# Altium schematic sheet LM-003.SchDoc (part 2 of 3)
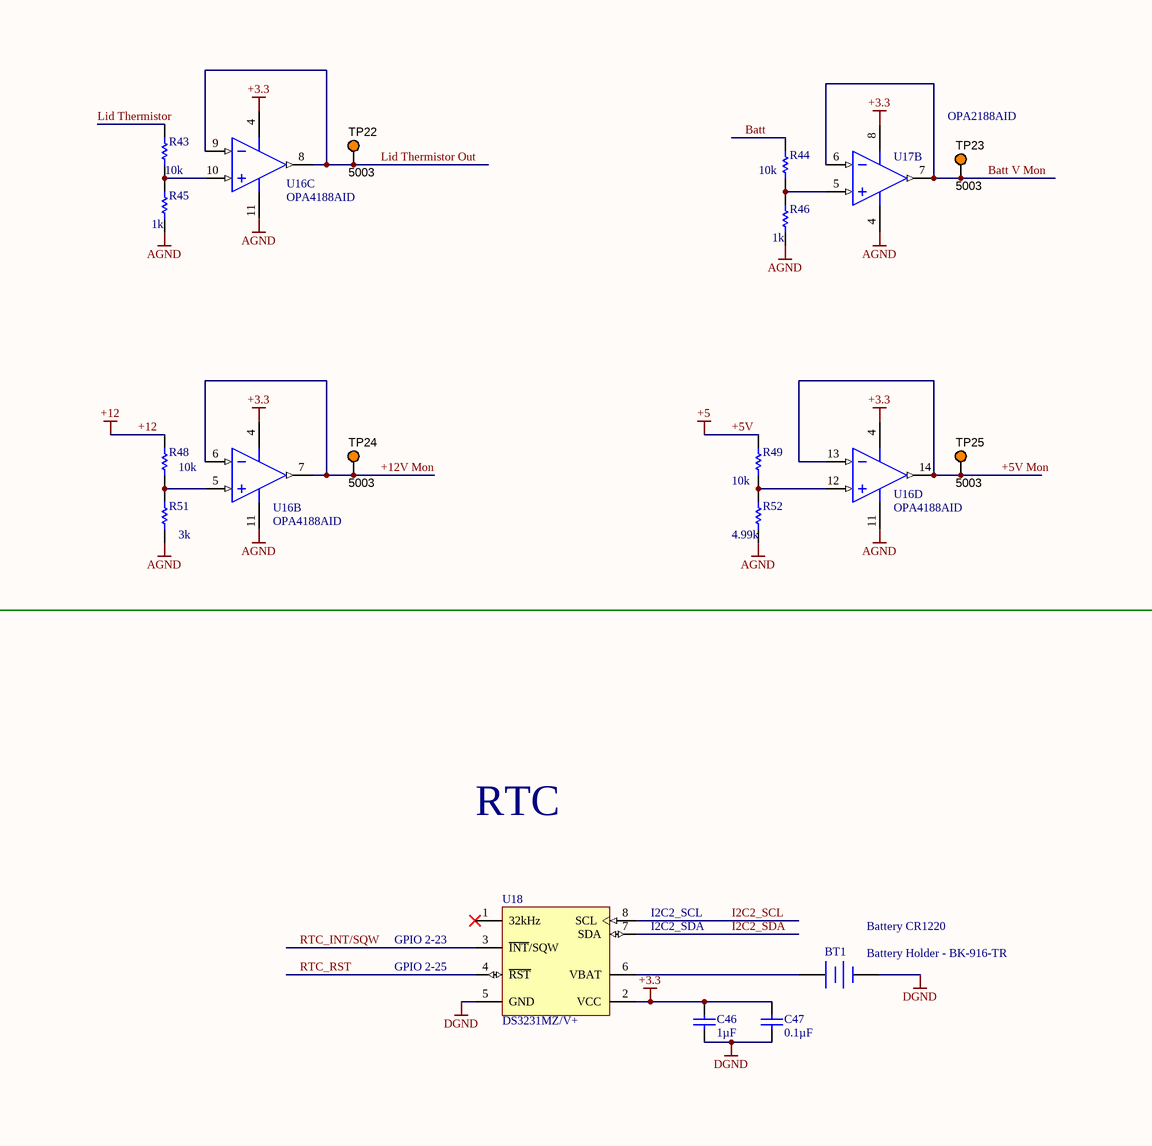
[diagram p9: LM-003.SchDoc, bottom right]
## Library data of the parts
BT1 = Battery: CR1220, 1225 BATTERY RETAINER W/; Manufacturer 1: MPD (Memory Protection Devices); Category 1: Battery Products; Battery Type, Function: Coin Cell, Retainer; Battery Cell Size: Coin, 12.0mm; Number of Cells: 1; Battery Series: 1216, 1220, 1225; Supplier 1: Digi-Key; Supplier Part Number 1: BK-916-CT-ND; Manufacturer Part Number 1: BK-916-TR; RoHS 1: RoHS Compliant; Description 1: CR1220, 1225 BATTERY RETAINER W/; Stock 1: 7084; Pricing 1: 1=0.49, 10=0.449, 100=0.408, 500=0.357 (USD); Part Status: Active; Style: Retainer; Mounting Type: PCB, Surface Mount; Termination Style: SMD (SMT) Tab; Height Above Board: 0.551" (14.00mm); Operating Temperature: -; ComponentLink1URL: http://www.memoryprotectiondevices.com/datasheets/BK-916-datasheet.pdf; ComponentLink1Description: http://www.memoryprotectiondevices.com/datasheets/BK-916-datasheet.pdf
C1 C2 = CMP-1037-04913-1: Manufacturer: Murata Electronics North America; Manufacturer Part Number: GRM32RR71H105KA01L; Tolerance: ±10%; Supplier 1: Digi-Key; Supplier Part Number 1: 490-1863-6-ND; RoHS: RoHS Compliant; Category: Capacitors; Stock 1: 66890; Pricing 1: 1=0.35, 10=0.242, 100=0.1449, 500=0.10868 (USD); Packaging: Digi-Reel®; Part Status: Active; Voltage - Rated: 50V; Temperature Coefficient: X7R; Operating Temperature: -55°C ~ 125°C; Features: -; Ratings: -; Applications: General Purpose; Mounting Type: Surface Mount, MLCC; Package / Case: 1210 (3225 Metric); Size / Dimension: 0.126" L x 0.098" W (3.20mm x 2.50mm); Height - Seated (Max): -; Thickness (Max): 0.079" (2.00mm); Lead Spacing: -; Lead Style: -; ComponentLink1URL: http://search.murata.co.jp/Ceramy/image/img/A01X/G101/ENG/GRM32RR71H105KA01-01.pdf; ComponentLink1Description: http://search.murata.co.jp/Ceramy/image/img/A01X/G101/ENG/GRM32RR71H105KA01-01.pdf
C3 = CMP-1035-00578-1: Manufacturer: AVX Corporation; Manufacturer Part Number: 06035C220JAT2A; Tolerance: ±5%; Supplier 1: Digi-Key; Supplier Part Number 1: 478-6204-6-ND; RoHS: RoHS Compliant; Category: Capacitors; Stock 1: 72942; Pricing 1: 1=0.2, 10=0.136, 100=0.0688, 1000=0.04166 (USD); Packaging: Digi-Reel®; Part Status: Active; Voltage - Rated: 50V; Temperature Coefficient: X7R; Operating Temperature: -55°C ~ 125°C; Features: -; Ratings: -; Applications: General Purpose; Mounting Type: Surface Mount, MLCC; Package / Case: 0603 (1608 Metric); Size / Dimension: 0.063" L x 0.032" W (1.60mm x 0.81mm); Height - Seated (Max): -; Thickness (Max): 0.035" (0.90mm); Lead Spacing: -; Lead Style: -; ComponentLink1URL: http://datasheets.avx.com/X7RDielectric.pdf; ComponentLink1Description: http://datasheets.avx.com/X7RDielectric.pdf
C4 C7 = CMP-1036-04795-1: Manufacturer: Taiyo Yuden; Manufacturer Part Number: EMK212B7105KG-T; Tolerance: ±10%; Supplier 1: Digi-Key; Supplier Part Number 1: 587-1283-1-ND; RoHS: RoHS Compliant; Category: Capacitors; Stock 1: 41495; Pricing 1: 1=0.13, 10=0.089, 100=0.042, 1000=0.02439 (USD); Packaging: Cut Tape (CT); Part Status: Active; Voltage - Rated: 16V; Temperature Coefficient: X7R; Operating Temperature: -55°C ~ 125°C; Features: -; Ratings: -; Applications: General Purpose; Mounting Type: Surface Mount, MLCC; Package / Case: 0805 (2012 Metric); Size / Dimension: 0.079" L x 0.049" W (2.00mm x 1.25mm); Height - Seated (Max): -; Thickness (Max): 0.053" (1.35mm); Lead Spacing: -; Lead Style: -; ComponentLink1URL: http://ds.yuden.co.jp/TYCOMPAS/ut/detail.do?productNo=EMK212B7105KG-T&fileName=EMK212B7105KG-T_SS&mode=specSheetDownload; ComponentLink1Description: http://ds.yuden.co.jp/TYCOMPAS/ut/detail.do?productNo=EMK212B7105KG-T&fileName=EMK212B7105KG-T_SS&mode=specSheetDownload
C5 = CMP-1037-04913-1: Manufacturer: Murata Electronics North America; Manufacturer Part Number: GRM31MR71H474KA01L; Tolerance: ±10%; Supplier 1: Digi-Key; Supplier Part Number 1: 490-1781-6-ND; RoHS: RoHS Compliant; Category: Capacitors; Stock 1: 15644; Pricing 1: 1=0.45, 10=0.317, 100=0.209, 500=0.15482, 1000=0.13159 (USD); Packaging: Digi-Reel®; Part Status: Active; Voltage - Rated: 50V; Temperature Coefficient: X7R; Operating Temperature: -55°C ~ 125°C; Features: -; Ratings: -; Applications: General Purpose; Mounting Type: Surface Mount, MLCC; Package / Case: 1206 (3216 Metric); Size / Dimension: 0.126" L x 0.063" W (3.20mm x 1.60mm); Height - Seated (Max): -; Thickness (Max): 0.049" (1.25mm); Lead Spacing: -; Lead Style: -; ComponentLink1URL: http://www.murata.com/~/media/webrenewal/support/library/catalog/products/capacitor/mlcc/c02e.ashx; ComponentLink1Description: http://www.murata.com/~/media/webrenewal/support/library/catalog/products/capacitor/mlcc/c02e.ashx
C6 C10 C41 C47 = CMP-1036-04416-1: CAP 100nF 25V -20% to +80% 0805 (2012 Metric) Thickness 1mm SMD; Manufacturer: Murata Electronics North America; Manufacturer Part Number: GRM21BR71E104KA01L; Tolerance: ±10%; Temperature Coefficient: X7R; Supplier 1: Digi-Key; Supplier Part Number 1: 490-1673-1-ND; RoHS: RoHS Compliant; Category: Capacitors; Stock 1: 895391; Pricing 1: 1=0.2, 10=0.145, 100=0.0683, 500=0.04788, 1000=0.03964 (USD); Packaging: Cut Tape (CT); Part Status: Active; Voltage - Rated: 25V; Operating Temperature: -55°C ~ 125°C; Features: -; Ratings: -; Applications: General Purpose; Mounting Type: Surface Mount, MLCC; Package / Case: 0805 (2012 Metric); Size / Dimension: 0.079" L x 0.049" W (2.00mm x 1.25mm); Height - Seated (Max): -; Thickness (Max): 0.053" (1.35mm); Lead Spacing: -; Lead Style: -; ComponentLink1URL: http://www.murata.com/~/media/webrenewal/support/library/catalog/products/capacitor/mlcc/c02e.ashx; ComponentLink1Description: http://www.murata.com/~/media/webrenewal/support/library/catalog/products/capacitor/mlcc/c02e.ashx
C8 = CMP-1037-04913-1: Manufacturer: Taiyo Yuden; Manufacturer Part Number: EMK316B7475KL-T; Tolerance: ±10%; Supplier 1: Digi-Key; Supplier Part Number 1: 587-1331-6-ND; RoHS: RoHS Compliant; Category: Capacitors; Stock 1: 59490; Pricing 1: 1=0.25, 10=0.17, 100=0.0965, 1000=0.0596 (USD); Packaging: Digi-Reel®; Part Status: Active; Voltage - Rated: 16V; Temperature Coefficient: X7R; Operating Temperature: -55°C ~ 125°C; Features: -; Ratings: -; Applications: General Purpose; Mounting Type: Surface Mount, MLCC; Package / Case: 1206 (3216 Metric); Size / Dimension: 0.126" L x 0.063" W (3.20mm x 1.60mm); Height - Seated (Max): -; Thickness (Max): 0.071" (1.80mm); Lead Spacing: -; Lead Style: -; ComponentLink1URL: http://ds.yuden.co.jp/TYCOMPAS/ut/detail.do?productNo=EMK316B7475KL-T&fileName=EMK316B7475KL-T_SS&mode=specSheetDownload; ComponentLink1Description: http://ds.yuden.co.jp/TYCOMPAS/ut/detail.do?productNo=EMK316B7475KL-T&fileName=EMK316B7475KL-T_SS&mode=specSheetDownload
C9 = CMP-1036-04795-1: Manufacturer: Murata Electronics North America; Manufacturer Part Number: GRM188R71C473KA01D; Tolerance: ±10%; Supplier 1: Digi-Key; Supplier Part Number 1: 490-1529-6-ND; RoHS: RoHS Compliant; Category: Capacitors; Stock 1: 26; Pricing 1: 1=0.1, 10=0.046, 100=0.0206, 500=0.0147, 1000=0.01155 (USD); Packaging: Digi-Reel®; Part Status: Active; Voltage - Rated: 16V; Temperature Coefficient: X7R; Operating Temperature: -55°C ~ 125°C; Features: -; Ratings: -; Applications: General Purpose; Mounting Type: Surface Mount, MLCC; Package / Case: 0603 (1608 Metric); Size / Dimension: 0.063" L x 0.031" W (1.60mm x 0.80mm); Height - Seated (Max): -; Thickness (Max): 0.035" (0.90mm); Lead Spacing: -; Lead Style: -; ComponentLink1URL: http://www.murata.com/~/media/webrenewal/support/library/catalog/products/capacitor/mlcc/c02e.ashx; ComponentLink1Description: http://www.murata.com/~/media/webrenewal/support/library/catalog/products/capacitor/mlcc/c02e.ashx
C11 C13-C17 C20 C21 C23 C25 C32 C42 C44 C45 = CMP-1036-04795-1: Manufacturer: Murata Electronics North America; Manufacturer Part Number: GRM21BR71E104KA01L; Tolerance: ±10%; Supplier 1: Digi-Key; Supplier Part Number 1: 490-1673-6-ND; RoHS: RoHS Compliant; Category: Capacitors; Stock 1: 891652; Pricing 1: 1=0.2, 10=0.145, 100=0.0683, 500=0.04788, 1000=0.03964 (USD); Packaging: Digi-Reel®; Part Status: Active; Voltage - Rated: 25V; Temperature Coefficient: X7R; Operating Temperature: -55°C ~ 125°C; Features: -; Ratings: -; Applications: General Purpose; Mounting Type: Surface Mount, MLCC; Package / Case: 0805 (2012 Metric); Size / Dimension: 0.079" L x 0.049" W (2.00mm x 1.25mm); Height - Seated (Max): -; Thickness (Max): 0.053" (1.35mm); Lead Spacing: -; Lead Style: -; ComponentLink1URL: http://www.murata.com/~/media/webrenewal/support/library/catalog/products/capacitor/mlcc/c02e.ashx; ComponentLink1Description: http://www.murata.com/~/media/webrenewal/support/library/catalog/products/capacitor/mlcc/c02e.ashx
C12 = CMP-1036-04795-1: Manufacturer: Murata Electronics North America; Manufacturer Part Number: GRM219R71E474KA88D; Tolerance: ±10%; Supplier 1: Digi-Key; Supplier Part Number 1: 490-11584-6-ND; RoHS: RoHS Compliant; Category: Capacitors; Stock 1: 575; Pricing 1: 1=0.33, 10=0.229, 100=0.1377, 500=0.10324, 1000=0.08718 (USD); Packaging: Digi-Reel®; Part Status: Active; Voltage - Rated: 25V; Temperature Coefficient: X7R; Operating Temperature: -55°C ~ 125°C; Features: -; Ratings: -; Applications: General Purpose; Mounting Type: Surface Mount, MLCC; Package / Case: 0805 (2012 Metric); Size / Dimension: 0.079" L x 0.049" W (2.00mm x 1.25mm); Height - Seated (Max): -; Thickness (Max): 0.037" (0.95mm); Lead Spacing: -; Lead Style: -; ComponentLink1URL: http://www.murata.com/~/media/webrenewal/support/library/catalog/products/capacitor/mlcc/c02e.ashx; ComponentLink1Description: http://www.murata.com/~/media/webrenewal/support/library/catalog/products/capacitor/mlcc/c02e.ashx
C18 C34 = CMP-1036-04795-1: Manufacturer: Murata Electronics North America; Manufacturer Part Number: GRM219R71C104KA01D; Tolerance: ±10%; Voltage - Rated: 25V; Supplier Part Number 1: 490-1673-6-ND; Temperature Coefficient: X7R; Thickness (Max): 0.053" (1.35mm); Supplier 2: Digi-Key; Supplier Part Number 2: 490-1683-6-ND; RoHS: RoHS Compliant; Category: Capacitors; Stock 2: 245331; Pricing 2: 1=0.14, 10=0.098, 100=0.0462, 500=0.0324, 1000=0.02683 (USD); Packaging: Digi-Reel®; Part Status: Active; Operating Temperature: -55°C ~ 125°C; Features: -; Ratings: -; Applications: General Purpose; Mounting Type: Surface Mount, MLCC; Package / Case: 0805 (2012 Metric); Size / Dimension: 0.079" L x 0.049" W (2.00mm x 1.25mm); Height - Seated (Max): -; Lead Spacing: -; Lead Style: -; ComponentLink1URL: http://www.murata.com/~/media/webrenewal/support/library/catalog/products/capacitor/mlcc/c02e.ashx; ComponentLink1Description: http://www.murata.com/~/media/webrenewal/support/library/catalog/products/capacitor/mlcc/c02e.ashx
C19 C27 C37 = CMP-1040-00561-1: Manufacturer: Kemet; Manufacturer Part Number: C1812C471KHRACTU; Tolerance: 10%; Supplier 1: Digi-Key; Supplier Part Number 1: 399-7289-6-ND; Stock 1: 2705; Pricing 1: 1=0.88, 10=0.666, 100=0.4761 (USD); Case/Package: 1812; Case Code (Metric): 4532; Case Code (Imperial): 1812; Min Operating Temperature: -55°C; Max Operating Temperature: 125°C; Voltage Rating: 3kV; Packaging: Tape and Reel; Package Quantity: 1; Voltage Rating (DC): 3kV; Length: 0.177inch; Width: 0.126inch; Thickness: 0.071inch; Lead Free: Lead Free; ComponentLink1URL: http://www.kemet.com/docfinder?Partnumber=C1812C471KHRACTU; ComponentLink1Description: http://www.kemet.com/docfinder?Partnumber=C1812C471KHRACTU
C22 = CMP-1040-00561-1: CAP CER 470PF 3KV X7R 1812; Manufacturer: Kemet; Manufacturer Part Number: C1812C471KHRACTU; Tolerance: 10%; Supplier 1: Digi-Key; Supplier Part Number 1: 399-7289-6-ND; Stock 1: 2705; Pricing 1: 1=0.88, 10=0.666, 100=0.4761 (USD); Case/Package: 1812; Case Code (Metric): 4532; Case Code (Imperial): 1812; Min Operating Temperature: -55°C; Max Operating Temperature: 125°C; Capacitance: 470pF; Voltage Rating: 3kV; Packaging: Tape and Reel; Package Quantity: 1; Voltage Rating (DC): 3kV; Length: 0.177inch; Width: 0.126inch; Thickness: 0.071inch; Lead Free: Lead Free; ComponentLink1URL: http://www.kemet.com/docfinder?Partnumber=C1812C471KHRACTU; ComponentLink1Description: http://www.kemet.com/docfinder?Partnumber=C1812C471KHRACTU
C24 = CAP B: Manufacturer 1: Murata Electronics North America; Manufacturer Part Number 1: GRM21A5C2D100JW01D; Category 1: Capacitors; Tolerance: ±5%; Temperature Coefficient: C0G, NP0; Supplier 1: Digi-Key; Supplier Part Number 1: 490-14649-1-ND; RoHS 1: RoHS Compliant; Description 1: CAP CER 10PF 200V C0G/NP0 0805; Stock 1: 1350; Pricing 1: 1=0.29, 10=0.196, 25=0.1436, 50=0.1174, 100=0.0991, 250=0.08084, 500=0.06782, 1000=0.05999 (USD); Part Status: Active; Voltage - Rated: 200V; Operating Temperature: -55°C ~ 125°C; Features: -; Ratings: -; Applications: General Purpose; Failure Rate: -; Mounting Type: Surface Mount, MLCC; Package / Case: 0805 (2012 Metric); Size / Dimension: 0.079" L x 0.049" W (2.00mm x 1.25mm); Height - Seated (Max): -; Thickness (Max): 0.039" (1.00mm); Lead Spacing: -; Lead Style: -; ComponentLink1URL: http://search.murata.co.jp/Ceramy/image/img/A01X/G101/ENG/GRM21A5C2D100JW01-01.pdf; ComponentLink1Description: http://search.murata.co.jp/Ceramy/image/img/A01X/G101/ENG/GRM21A5C2D100JW01-01.pdf; Supplier 2: Digi-Key; Supplier Part Number 2: 490-14649-6-ND; Manufacturer: Murata Electronics North America; Manufacturer Part Number: GRM21A5C2D100JW01D; RoHS: RoHS Compliant; Category: Capacitors; Stock 2: 971; Pricing 2: 1=0.29, 10=0.196, 100=0.0991, 500=0.06782, 1000=0.05999 (USD); Packaging: Digi-Reel®
C26 = CAP B: Manufacturer 1: Lelon; Manufacturer Part Number 1: TEA471M1CBK-0816P; Case Diameter: 8 mm; Case Length: 16 mm; Dissipation Factor DF: 0.17; Load Life: 2000 h; Ripple Current: 460 mA; Product Status: Factory Special Order; Supplier 1: Mouser; Supplier Part Number 1: 140-TEA471M1CBK0816P; RoHS 1: RoHS Compliant; Description 1: Aluminum Electrolytic Capacitors - Leaded 16V 470uF 20%; Category 1: Aluminum Electrolytic Capacitors - Leaded; Stock 1: 0; Dimensions: 8 mm Dia. x 16 mm L; Product: General Purpose Electrolytic Capacitors; Series: TEA; Termination Style: Axial; Tolerance: 20 %; Voltage Rating DC: 16 V; Brand: Lelon; Maximum Operating Temperature: + 85 C; Product Category: Axial Electrolytic Capacitors; Standard Pack Qty: 500; RoHS - Mouser: Y; Minimum Order Quantity: 2000; Reeling: False; ComponentLink1URL: http://www.mouser.com/catalog/specsheets/ea.pdf; ComponentLink1Description: http://www.mouser.com/catalog/specsheets/ea.pdf
C28 = CMP-1036-04795-1: Manufacturer: Kemet; Manufacturer Part Number: C0805F103K5RACTU; Dielectric Material: Ceramic; Tolerance: 10%; Supplier 1: Digi-Key; Supplier Part Number 1: 399-5107-6-ND; Stock 1: 29640; Pricing 1: 1=0.29, 10=0.202, 100=0.1146, 500=0.0809, 1000=0.0708 (USD); Mount: Surface Mount; Case/Package: 0805; Number of Pins: 2; Case Code (Imperial): 0805; Case Code (Metric): 2012; Min Operating Temperature: -55°C; Max Operating Temperature: 125°C; Package Quantity: 4000; Voltage Rating: 50V; Voltage Rating (DC): 50V; Packaging: Cut Tape; Dielectric: X7R; Termination: SMD/SMT; Voltage: 50V; Length: 2mm; Height: 0.9mm; Width: 1.25mm; Thickness: 0.039inch; Depth: 1.25mm; Lead Pitch: 0.75mm; REACH SVHC: No SVHC; ComponentLink1URL: https://datasheet.ciiva.com/146/docfinderpartnumber-c0805f103k5ractu-146278.pdf; ComponentLink1Description: https://datasheet.ciiva.com/146/docfinderpartnumber-c0805f103k5ractu-146278.pdf; ComponentLink2URL: https://datasheet.ciiva.com/7842/48829-7842407.pdf; ComponentLink2Description: https://datasheet.ciiva.com/7842/48829-7842407.pdf; ComponentLink3URL: https://datasheet.ciiva.com/7842/48829-7842408.pdf; ComponentLink3Description: https://datasheet.ciiva.com/7842/48829-7842408.pdf
C29 C30 = CMP-1038-00632-1: Manufacturer: TDK Corporation; Manufacturer Part Number: C3216X5R1H685K160AB; Tolerance: ±10%; Supplier 1: Digi-Key; Supplier Part Number 1: 445-5996-6-ND; RoHS: RoHS Compliant; Category: Capacitors; Stock 1: 29817; Pricing 1: 1=1.03, 10=0.785, 100=0.5615, 500=0.4347, 1000=0.37433 (USD); Packaging: Digi-Reel®; Part Status: Active; Voltage - Rated: 50V; Temperature Coefficient: X5R; Operating Temperature: -55°C ~ 85°C; Features: Low ESL; Ratings: -; Applications: General Purpose; Failure Rate: -; Mounting Type: Surface Mount, MLCC; Package / Case: 1206 (3216 Metric); Size / Dimension: 0.126" L x 0.063" W (3.20mm x 1.60mm); Height - Seated (Max): -; Thickness (Max): 0.071" (1.80mm); Lead Spacing: -; Lead Style: -; ComponentLink1URL: https://product.tdk.com/info/en/catalog/datasheets/mlcc_commercial_general_en.pdf; ComponentLink1Description: https://product.tdk.com/info/en/catalog/datasheets/mlcc_commercial_general_en.pdf
C31 = CMP-1036-04795-1: Manufacturer: Kemet; Manufacturer Part Number: C0805X105K4RACTU; Dielectric Material: Ceramic; Tolerance: 10%; Dissipation Factor: 3.5%; Supplier 1: Digi-Key; Supplier Part Number 1: 399-5329-1-ND; Stock 1: 12821; Pricing 1: 1=0.72, 10=0.528, 100=0.3623, 500=0.2868, 1000=0.2415 (USD); Mount: Surface Mount; Case/Package: 0805; Case Code (Imperial): 0805; Case Code (Metric): 2012; Min Operating Temperature: -55°C; Max Operating Temperature: 125°C; Packaging: Tape and Reel; Voltage Rating (DC): 16V; Package Quantity: 1; Voltage Rating: 16V; Dielectric: X7R; Termination: SMD/SMT; Voltage: 16V; Length: 2.1mm; Height: 0.9mm; Width: 1.25mm; Thickness: 0.039inch; Depth: 1.25mm; Radiation Hardening: No; REACH SVHC: No SVHC; ComponentLink1URL: https://datasheet.ciiva.com/7842/1698763-7842475.pdf; ComponentLink1Description: https://datasheet.ciiva.com/7842/1698763-7842475.pdf; ComponentLink2URL: https://datasheet.ciiva.com/7842/1698763-7842476.pdf; ComponentLink2Description: https://datasheet.ciiva.com/7842/1698763-7842476.pdf; ComponentLink3URL: https://datasheet.ciiva.com/14593/70096394-14593295.pdf; ComponentLink3Description: https://datasheet.ciiva.com/14593/70096394-14593295.pdf
C33 = CMP-1038-00632-1: Manufacturer: Murata Electronics North America; Manufacturer Part Number: GRM32RR71H105KA01L; Tolerance: ±10%; Supplier 1: Digi-Key; Supplier Part Number 1: 490-1863-6-ND; RoHS: RoHS Compliant; Category: Capacitors; Stock 1: 66890; Pricing 1: 1=0.35, 10=0.242, 100=0.1449, 500=0.10868 (USD); Packaging: Digi-Reel®; Part Status: Active; Voltage - Rated: 50V; Temperature Coefficient: X7R; Operating Temperature: -55°C ~ 125°C; Features: -; Ratings: -; Applications: General Purpose; Mounting Type: Surface Mount, MLCC; Package / Case: 1210 (3225 Metric); Size / Dimension: 0.126" L x 0.098" W (3.20mm x 2.50mm); Height - Seated (Max): -; Thickness (Max): 0.079" (2.00mm); Lead Spacing: -; Lead Style: -; ComponentLink1URL: http://search.murata.co.jp/Ceramy/image/img/A01X/G101/ENG/GRM32RR71H105KA01-01.pdf; ComponentLink1Description: http://search.murata.co.jp/Ceramy/image/img/A01X/G101/ENG/GRM32RR71H105KA01-01.pdf
C35 = CMP-1036-04795-1: Manufacturer: Murata Electronics North America; Manufacturer Part Number: GRM216R71E103KA01D; Tolerance: ±10%; Supplier 1: Digi-Key; Supplier Part Number 1: 490-12748-6-ND; RoHS: RoHS Compliant; Category: Capacitors; Stock 1: 13127; Pricing 1: 1=0.11, 10=0.077, 100=0.0343, 500=0.02452, 1000=0.01926 (USD); Packaging: Digi-Reel®; Part Status: Active; Voltage - Rated: 25V; Temperature Coefficient: X7R; Operating Temperature: -55°C ~ 125°C; Features: -; Ratings: -; Applications: General Purpose; Mounting Type: Surface Mount, MLCC; Package / Case: 0805 (2012 Metric); Size / Dimension: 0.079" L x 0.049" W (2.00mm x 1.25mm); Height - Seated (Max): -; Thickness (Max): 0.028" (0.70mm); Lead Spacing: -; Lead Style: -; ComponentLink1URL: http://www.murata.com/~/media/webrenewal/support/library/catalog/products/capacitor/mlcc/c02e.ashx; ComponentLink1Description: http://www.murata.com/~/media/webrenewal/support/library/catalog/products/capacitor/mlcc/c02e.ashx
C36 = CMP-1036-04795-1: Manufacturer: Murata Electronics North America; Manufacturer Part Number: GCM21BR71A106KE22L; Tolerance: ±10%; Supplier 1: Digi-Key; Supplier Part Number 1: 490-10674-6-ND; RoHS: RoHS Compliant; Category: Capacitors; Stock 1: 136726; Pricing 1: 1=0.49, 10=0.347, 100=0.2282, 500=0.16906, 1000=0.14369 (USD); Packaging: Digi-Reel®; Part Status: Active; Voltage - Rated: 10V; Temperature Coefficient: X7R; Operating Temperature: -55°C ~ 125°C; Features: -; Ratings: AEC-Q200; Applications: Automotive; Mounting Type: Surface Mount, MLCC; Package / Case: 0805 (2012 Metric); Size / Dimension: 0.079" L x 0.049" W (2.00mm x 1.25mm); Height - Seated (Max): -; Thickness (Max): 0.055" (1.40mm); Lead Spacing: -; Lead Style: -; ComponentLink1URL: http://search.murata.co.jp/Ceramy/image/img/A01X/G101/ENG/GCM21BR71A106KE22-01.pdf; ComponentLink1Description: http://search.murata.co.jp/Ceramy/image/img/A01X/G101/ENG/GCM21BR71A106KE22-01.pdf
C38 C39 = CMP-1036-04882-1: Manufacturer: Murata Electronics North America; Manufacturer Part Number: GRM21BR71E105KA99L; Tolerance: ±10%; Supplier 1: Digi-Key; Supplier Part Number 1: 490-6484-6-ND; RoHS: RoHS Compliant; Category: Capacitors; Stock 1: 295074; Pricing 1: 1=0.14, 10=0.099, 100=0.0468, 500=0.0328, 1000=0.02715 (USD); Packaging: Digi-Reel®; Part Status: Active; Voltage - Rated: 25V; Temperature Coefficient: X7R; Operating Temperature: -55°C ~ 125°C; Features: -; Ratings: -; Applications: General Purpose; Mounting Type: Surface Mount, MLCC; Package / Case: 0805 (2012 Metric); Size / Dimension: 0.079" L x 0.049" W (2.00mm x 1.25mm); Height - Seated (Max): -; Thickness (Max): 0.053" (1.35mm); Lead Spacing: -; Lead Style: -; ComponentLink1URL: http://www.murata.com/~/media/webrenewal/support/library/catalog/products/capacitor/mlcc/c02e.ashx; ComponentLink1Description: http://www.murata.com/~/media/webrenewal/support/library/catalog/products/capacitor/mlcc/c02e.ashx
C40 = CMP-1036-04882-1: Manufacturer: Murata Electronics North America; Manufacturer Part Number: GRM21BR71E104KA01L; Tolerance: ±10%; Supplier 1: Digi-Key; Supplier Part Number 1: 490-1673-6-ND; RoHS: RoHS Compliant; Category: Capacitors; Stock 1: 891652; Pricing 1: 1=0.2, 10=0.145, 100=0.0683, 500=0.04788, 1000=0.03964 (USD); Packaging: Digi-Reel®; Part Status: Active; Voltage - Rated: 25V; Temperature Coefficient: X7R; Operating Temperature: -55°C ~ 125°C; Features: -; Ratings: -; Applications: General Purpose; Mounting Type: Surface Mount, MLCC; Package / Case: 0805 (2012 Metric); Size / Dimension: 0.079" L x 0.049" W (2.00mm x 1.25mm); Height - Seated (Max): -; Thickness (Max): 0.053" (1.35mm); Lead Spacing: -; Lead Style: -; ComponentLink1URL: http://www.murata.com/~/media/webrenewal/support/library/catalog/products/capacitor/mlcc/c02e.ashx; ComponentLink1Description: http://www.murata.com/~/media/webrenewal/support/library/catalog/products/capacitor/mlcc/c02e.ashx
C43 = CMP-1036-04795-1: Manufacturer: Kemet; Manufacturer Part Number: C0805C103K5RACAUTO; Voltage Rating: 50V; Supplier 1: Digi-Key; Supplier Part Number 1: 399-6924-1-ND; Stock 1: 63236; Pricing 1: 1=0.12, 10=0.087, 100=0.041, 500=0.0287, 1000=0.0238 (USD); Mount: Surface Mount; Case/Package: 0805; Case Code (Metric): 2012; Case Code (Imperial): 0805; Dielectric Material: Ceramic; Contact Plating: Tin; Min Operating Temperature: -55°C; Max Operating Temperature: 125°C; Tolerance: 10%; Packaging: Tape and Reel; Package Quantity: 1; Voltage Rating (DC): 50V; Dielectric: X7R; Termination: SMD/SMT; Length: 2mm; Height: 0.78mm; Width: 0.049inch; Thickness: 0.035inch; Depth: 1.25mm; Radiation Hardening: No; REACH SVHC: No SVHC; ComponentLink1URL: https://datasheet.ciiva.com/22700/1693454-22700519.pdf; ComponentLink1Description: https://datasheet.ciiva.com/22700/1693454-22700519.pdf; ComponentLink2URL: https://datasheet.ciiva.com/7842/1693454-7842175.pdf; ComponentLink2Description: https://datasheet.ciiva.com/7842/1693454-7842175.pdf
C46 = CMP-1036-04754-1: CAP 1uF 25V ±10% 0805 (2012 Metric) Thickness 1mm SMD; Manufacturer: Murata Electronics North America; Manufacturer Part Number: GRM21BR71E105KA99L; Temperature Coefficient: X7R; Supplier 1: Digi-Key; Supplier Part Number 1: 490-6484-1-ND; RoHS: RoHS Compliant; Category: Capacitors; Stock 1: 295334; Pricing 1: 1=0.14, 10=0.099, 100=0.0468, 1000=0.02715 (USD); Packaging: Cut Tape (CT); Part Status: Active; Tolerance: ±10%; Voltage - Rated: 25V; Operating Temperature: -55°C ~ 125°C; Features: -; Ratings: -; Applications: General Purpose; Mounting Type: Surface Mount, MLCC; Package / Case: 0805 (2012 Metric); Size / Dimension: 0.079" L x 0.049" W (2.00mm x 1.25mm); Height - Seated (Max): -; Thickness (Max): 0.053" (1.35mm); Lead Spacing: -; Lead Style: -; ComponentLink1URL: http://www.murata.com/~/media/webrenewal/support/library/catalog/products/capacitor/mlcc/c02e.ashx; ComponentLink1Description: http://www.murata.com/~/media/webrenewal/support/library/catalog/products/capacitor/mlcc/c02e.ashx
D1 = DIODE A/K A: DIODE GP 50V 6A MICRODE BUTTON; Manufacturer 1: ON Semiconductor; Category 1: Discrete Semiconductor Products; Diode Type: Standard; Voltage - Forward (Vf) (Max) @ If: 900mV @ 6A; Speed: Standard Recovery >500ns, > 200mA (Io); Current - Reverse Leakage @ Vr: 25µA @ 50V; Supplier 1: Digi-Key; Supplier Part Number 1: MR750-ND; Manufacturer Part Number 1: MR750; RoHS 1: RoHS non-compliant; Description 1: DIODE GP 50V 6A MICRODE BUTTON; Stock 1: 0; Pricing 1: 1000=0 (USD); Packaging: Bulk; Voltage - DC Reverse (Vr) (Max): 50V; Current - Average Rectified (Io): 6A; Reverse Recovery Time (trr): -; Capacitance @ Vr, F: -; Mounting Type: Through Hole; Package / Case: Button, Axial; Supplier Device Package: Microde Button; Operating Temperature - Junction: -65°C ~ 175°C; ComponentLink1URL: http://www.onsemi.com/pub_link/Collateral/MR750-D.PDF; ComponentLink1Description: http://www.onsemi.com/pub_link/Collateral/MR750-D.PDF
DS1 = CMP-0239-00001-1: LED 468NM BLUE CLEAR 0603 SMD; Manufacturer 1: Lite-On Inc; Manufacturer Part Number 1: LTST-C191TBKT; Category 1: Optoelectronics; Wavelength - Dominant: 467.5nm; Millicandela Rating: 30mcd; Voltage - Forward (Vf) (Typ): 3.4V; Current - Test: 20mA; Viewing Angle: 130°; Lens Style/Size: Rectangle with Flat Top, 1.1mm x 0.8mm; Supplier 1: Digi-Key; Supplier Part Number 1: 160-1647-1-ND; RoHS 1: RoHS Compliant; Description 1: LED 468NM BLUE CLEAR 0603 SMD; Stock 1: 267074; Pricing 1: 1=0.46, 10=0.342, 100=0.1813, 250=0.12824, 500=0.10944, 1000=0.0855, 2500=0.07524 (USD); Packaging: Cut Tape (CT); Color: Blue; Wavelength - Peak: 468nm; Lens Type: Clear; Package / Case: 0603 (1608 Metric); Size / Dimension: 1.60mm L x 0.80mm W; Height: 0.55mm; Mounting Type: Surface Mount; Luminous Flux @ Current - Test: -; ComponentLink1URL: http://optoelectronics.liteon.com/upload/download/DS22-2000-230/S_110_LTST-C191TBKT.pdf; ComponentLink1Description: http://optoelectronics.liteon.com/upload/download/DS22-2000-230/S_110_LTST-C191TBKT.pdf
DS2-DS6 = CMP-0245-00001-1: 2.1x0.7mm Right Angle SMT LED, 1.3mm Thickness, Red; Forward Current: 30 mA; Reverse Voltage: 5 V; Power Dissipation: 75 mW; Emitting Color: Red; DatasheetVersion: Rev. 8, 06/2011; ComponentLink2Description: Datasheet; Mounting Technology: Surface Mount; ComponentLink2URL: http://www.kingbrightusa.com/images/catalog/SPEC/APJA2107EC.pdf; PartNumber: APJA2107EC; PackageDescription: 2-Pin Right Angle SMT LED, 2.1x0.7 mm Body, 1.3mm Thickness; ComponentLink1Description: Manufacturer URL; Storage Temperature: -40 to 85 degC; PackageReference: LED2107-13-RED-2; ComponentLink1URL: http://www.kingbrightusa.com/; PackageVersion: Rev. 8, 6/2011
F1 = Fuse 2: FUSE HOLDER BLADE 32V 15A PCB; Manufacturer 1: Littelfuse Inc.; Manufacturer Part Number 1: 01530007Z; Category 1: Circuit Protection; For Use With/Related Products: MINI ATC, MINI ATO; Fuse Size: 0.43" L x 0.15" W x 0.64" H (10.92mm x 3.81mm x 16.25mm); Number of Circuits: 1; Supplier 1: Digi-Key; Supplier Part Number 1: F064-ND; RoHS 1: RoHS Compliant; Description 1: FUSE HOLDER BLADE 32V 15A PCB; Stock 1: 4234; Pricing 1: 1=3.45, 5=3.336, 10=3.22, 50=2.53, 100=2.07, 250=2.01252, 500=1.725, 1000=1.61, 5000=1.4375 (USD); Part Status: Active; Fuseholder Type: Holder; Fuse Type: Blade; Voltage: 32V; Current Rating: 15A; Mounting Type: PCB; Orientation: Horizontal; Termination Style: PC Pin; Contact Material: Copper Alloy; Contact Finish: Tin; ComponentLink1URL: http://www.littelfuse.com/~/media/commercial-vehicle/datasheets/automotive-fuse-holders/mini/littelfuse_fuse-holders-mini-153-pc-datasheet.pdf; ComponentLink1Description: http://www.littelfuse.com/~/media/commercial-vehicle/datasheets/automotive-fuse-holders/mini/littelfuse_fuse-holders-mini-153-pc-datasheet.pdf
L1 = Inductor: Manufacturer 1: Murata Electronics North America; Manufacturer Part Number 1: LQH32CN470K23L; Category 1: Inductors, Coils, Chokes; Type: Wirewound; Material - Core: Ferrite; Tolerance: ±10%; Shielding: Unshielded; DC Resistance (DCR): 1.3 Ohm; Frequency - Self Resonant: 15MHz; Frequency - Test: 1MHz; Supplier 1: Digi-Key; Supplier Part Number 1: 490-2497-1-ND; RoHS 1: RoHS Compliant; Description 1: FIXED IND 47UH 170MA 1.3 OHM SMD; Stock 1: 39785; Pricing 1: 1=0.32, 10=0.291, 25=0.2584, 50=0.2262, 100=0.21, 250=0.1938, 500=0.18412, 750=0.16796, 1000=0.14858 (USD); Packaging: Cut Tape (CT); Current Rating: 170mA; Current - Saturation: -; Q @ Freq: -; Operating Temperature: -40°C ~ 85°C; Mounting Type: Surface Mount; Package / Case: 1210 (3225 Metric); Size / Dimension: 0.126" L x 0.098" W (3.20mm x 2.50mm); Height - Seated (Max): 0.067" (1.70mm); Supplier Device Package: 1210; ComponentLink1URL: http://search.murata.co.jp/Ceramy/image/img/PDF/ENG/L0075S0093LQH32C_23~33.pdf; ComponentLink1Description: http://search.murata.co.jp/Ceramy/image/img/PDF/ENG/L0075S0093LQH32C_23~33.pdf
LED1 = LED A/K: LED 2MM X 5MM RT ANGLE GRN PCMNT; Manufacturer 1: Dialight; Manufacturer Part Number 1: 5660206F; Category 1: Optoelectronics; Wavelength - Peak: 565nm; Configuration: Single; Current: 20mA; Millicandela Rating: 4mcd; Viewing Angle: 110°; Lens Type: Diffused, Tinted; Lens Style/Size: Rectangle with Flat Top, 5.00mm x 2.00mm; Voltage Rating: 2.2V; Supplier 1: Digi-Key; Supplier Part Number 1: 350-1762-ND; RoHS 1: RoHS Compliant; Description 1: LED 2MM X 5MM RT ANGLE GRN PCMNT; Stock 1: 807; Pricing 1: 1=1.85, 10=1.507, 25=1.1588, 100=1.0431, 250=0.9272, 500=0.7881, 1000=0.64903, 2500=0.61658, 5000=0.60267 (USD); Packaging: Bulk; Part Status: Active; Color: Green; Mounting Type: Through Hole, Right Angle; ComponentLink1URL: http://www.dialight.com/Assets/Brochures_And_Catalogs/Indication/566-xx06.pdf; ComponentLink1Description: http://www.dialight.com/Assets/Brochures_And_Catalogs/Indication/566-xx06.pdf
LED2 = LED A/K: LED 2MM X 5MM RT ANGLE YEL PCMNT; Manufacturer 1: Dialight; Manufacturer Part Number 1: 5660306F; Category 1: Optoelectronics; Wavelength - Peak: 583nm; Configuration: Single; Current: 20mA; Millicandela Rating: 3.5mcd; Viewing Angle: 110°; Lens Type: Diffused, Tinted; Lens Style/Size: Rectangle with Flat Top, 5.00mm x 2.00mm; Voltage Rating: 2.1V; Supplier 1: Digi-Key; Supplier Part Number 1: 350-1764-ND; RoHS 1: RoHS Compliant; Description 1: LED 2MM X 5MM RT ANGLE YEL PCMNT; Stock 1: 594; Pricing 1: 1=1.85, 10=1.507, 25=1.1588, 100=1.0431, 250=0.9272, 500=0.7881, 1000=0.64903, 2500=0.61658, 5000=0.60267 (USD); Packaging: Bulk; Part Status: Active; Color: Yellow; Mounting Type: Through Hole, Right Angle; ComponentLink1URL: http://www.dialight.com/Assets/Brochures_And_Catalogs/Indication/566-xx06.pdf; ComponentLink1Description: http://www.dialight.com/Assets/Brochures_And_Catalogs/Indication/566-xx06.pdf
P1 = Header 2X2: Header, 2-Pin, Dual row; Manufacturer 1: TE Connectivity AMP Connectors; Manufacturer Part Number 1: 1-87215-0; Description 1: CONN HEADER VERT 2POS .100 30AU; Category 1: Connectors, Interconnects; Style: Board to Board or Cable; Shrouding: Unshrouded; Number of Positions: 2; Number of Positions Loaded: All; Row Spacing - Mating: 0.100" (2.54mm); Contact Length - Mating: 0.318" (8.08mm); Contact Length - Post: 0.125" (3.18mm); Overall Contact Length: 0.533" (13.55mm); Material Flammability Rating: UL94 V-0; Current Rating: 3A; Supplier 1: Digi-Key; Supplier Part Number 1: A26564-ND; RoHS 1: RoHS Compliant; Stock 1: 9703; Pricing 1: 1=1.42, 10=1.287, 50=1.1554, 100=1.1029, 250=0.99784, 500=0.91906, 1000=0.78777, 2500=0.73525 (USD); Packaging: Bulk; Part Status: Active; Connector Type: Header; Contact Type: Male Pin; Pitch - Mating: -; Number of Rows: 2; Mounting Type: Through Hole; Termination: Solder; Fastening Type: Push-Pull; Insulation Height: 0.090" (2.29mm); Contact Shape: Circular; Contact Finish - Mating: Gold; Contact Finish Thickness - Mating: 30µin (0.76µm); Contact Finish - Post: Gold; Contact Material: Phosphor Bronze; Insulation Material: Thermoplastic; Features: -; Operating Temperature: -65°C ~ 105°C; Ingress Protection: -; Insulation Color: Black; Voltage Rating: -; Mated Stacking Heights: -; Contact Finish Thickness - Post: Flash; Applications: -; ComponentLink1URL: http://www.te.com/commerce/DocumentDelivery/DDEController?Action=srchrtrv&DocNm=87215&DocType=Customer+Drawing&DocLang=English; ComponentLink1Description: http://www.te.com/commerce/DocumentDelivery/DDEController?Action=srchrtrv&DocNm=87215&DocType=Customer+Drawing&DocLang=English
P2 = Header 6X2: Header, 6-Pin, Dual row; Manufacturer: Samtec; Connector Type: Male Header; No. of positions: 6; No. of Rows: 2; Pitch: 0.8mm; Number of Positions: 12; Number of Positions Loaded: All; Row Spacing: 0.047" (1.20mm); Molding Height Above Board: 0.067" (1.70mm); Pitch Spacing: 0.8; Contact Termination: Surface Mount Vertical; LatestRevisionDate: 17-Jul-2002; LatestRevisionNote: Re-released for DXP Platform.; Publisher: Altium Limited; Supplier 1: Newark; ComponentLink1URL: http://www.samtec.com/; ComponentLink2URL: http://www.samtec.com/technical-specifications/Default.aspx?SeriesMaster=FTE; Mounting Technology: Surface Mount; Supplier 2: Digi-Key; Manufacturer Part Number: FTE-106-01-G-DV; RoHS: RoHS Compliant; Category: Connectors, Interconnects; Stock 2: 0; Pricing 2: 1=7.49, 10=6.49, 100=5.4911, 500=4.36794, 1000=3.55676, 5000=3.24476, 10000=3.11996 (USD); Packaging: Tube; Number of Rows: 2; Height Stacking (Mating): -; Contact Mating Length: 0.075" (1.90mm); Mounting Type: Surface Mount; Termination: Solder; Contact Finish: Gold; Contact Finish Thickness: 10µin (0.25µm); Features: -; Color: Black; ComponentLink3URL: http://www.samtec.com/documents/webfiles/pdf/FTE_SM.PDF; ComponentLink3Description: http://www.samtec.com/documents/webfiles/pdf/FTE_SM.PDF; Stock 1: 0; Pricing 1: 1=3.26, 10=2.85, 100=2.43, 500=2, 1000=1.72, 5000=1.55, 10000=1.48 (USD); Series: FTE; No. of Contacts: 12; Gender: Header; Contact Plating: Gold; Contact Material: Phosphor Bronze; ComponentLink4URL: http://www.samtec.com/ftppub/pdf/FTE_SM.PDF; ComponentLink4Description: http://www.samtec.com/ftppub/pdf/FTE_SM.PDF; Supplier Part Number 1: 11P4479; Supplier Part Number 2: SAM1144-06-ND
P3 = Header 4X2H: Header, 4-Pin, Dual row, Right Angle; Manufacturer 1: Samtec Inc.; Description 1: .100 TERMINAL ASSY; Category 1: Connectors, Interconnects; Pitch - Mating: 0.100" (2.54mm); Style: Board to Cable/Wire; Shrouding: Shrouded - 4 Wall; Number of Positions: 4; Number of Positions Loaded: All; Contact Length - Mating: 0.215" (5.46mm); Contact Length - Post: 0.085" (2.16mm); Material Flammability Rating: UL94 V-0; Voltage Rating: 675VAC, 954VDC; Supplier 1: Digi-Key; Supplier Part Number 1: SAM9597-ND; Manufacturer Part Number 1: IPL1-104-01-L-S-RA-K; RoHS 1: RoHS Compliant; Stock 1: 100; Pricing 1: 1=2.53, 10=2.424, 25=2.222, 50=2.121, 100=2.02, 250=1.76752, 500=1.717, 1000=1.4645, 2500=1.3635 (USD); Packaging: Tube; Part Status: Active; Connector Type: Header; Contact Type: Male Pin; Number of Rows: 1; Row Spacing - Mating: -; Mounting Type: Through Hole, Right Angle; Termination: Solder; Fastening Type: Locking Ramp; Overall Contact Length: -; Insulation Height: 0.240" (6.10mm); Contact Shape: Square; Contact Finish - Mating: Gold; Contact Finish Thickness - Mating: 10µin (0.25µm); Contact Finish - Post: Tin; Contact Material: Phosphor Bronze; Insulation Material: Liquid Crystal Polymer (LCP); Features: -; Operating Temperature: -55°C ~ 125°C; Ingress Protection: -; Insulation Color: Natural; Current Rating: -; Mated Stacking Heights: -; Contact Finish Thickness - Post: -; Applications: -; ComponentLink1URL: http://suddendocs.samtec.com/prints/ipl1-1xx-xx-xxx-s-xx-x-xx-mkt.pdf; ComponentLink1Description: http://suddendocs.samtec.com/prints/ipl1-1xx-xx-xxx-s-xx-x-xx-mkt.pdf
P4-P6 P12 = 53047-0410: .100 TERMINAL ASSY; Manufacturer 1: Samtec Inc.; Category 1: Connectors, Interconnects; Connector Type: Header; Pitch - Mating: 0.100" (2.54mm); Style: Board to Cable/Wire; Shrouding: Shrouded - 4 Wall; Number of Positions: 4; Number of Positions Loaded: All; Contact Length - Mating: 0.215" (5.46mm); Contact Length - Post: 0.085" (2.16mm); Material Flammability Rating: UL94 V-0; Voltage Rating: 675VAC, 954VDC; Supplier 1: Digi-Key; Supplier Part Number 1: SAM9597-ND; Manufacturer Part Number 1: IPL1-104-01-L-S-RA-K; RoHS 1: RoHS Compliant; Description 1: .100 TERMINAL ASSY; Stock 1: 100; Pricing 1: 1=2.53, 10=2.424, 25=2.222, 50=2.121, 100=2.02, 250=1.76752, 500=1.717, 1000=1.4645, 2500=1.3635 (USD); Packaging: Tube; Part Status: Active; Contact Type: Male Pin; Number of Rows: 1; Row Spacing - Mating: -; Mounting Type: Through Hole, Right Angle; Termination: Solder; Fastening Type: Locking Ramp; Overall Contact Length: -; Insulation Height: 0.240" (6.10mm); Contact Shape: Square; Contact Finish - Mating: Gold; Contact Finish Thickness - Mating: 10µin (0.25µm); Contact Finish - Post: Tin; Contact Material: Phosphor Bronze; Insulation Material: Liquid Crystal Polymer (LCP); Features: -; Operating Temperature: -55°C ~ 125°C; Ingress Protection: -; Insulation Color: Natural; Current Rating: -; Mated Stacking Heights: -; Contact Finish Thickness - Post: -; Applications: -; ComponentLink1URL: http://suddendocs.samtec.com/prints/ipl1-1xx-xx-xxx-s-xx-x-xx-mkt.pdf; ComponentLink1Description: http://suddendocs.samtec.com/prints/ipl1-1xx-xx-xxx-s-xx-x-xx-mkt.pdf
P7 P13 = Header 2H: CONN SHROUDED PWR HEADER 2POS; Manufacturer 1: Samtec Inc.; Category 1: Connectors, Interconnects; Pitch - Mating: 0.100" (2.54mm); Style: Board to Cable/Wire; Shrouding: Shrouded - 4 Wall; Number of Positions: 2; Number of Positions Loaded: All; Contact Length - Mating: 0.215" (5.46mm); Contact Length - Post: 0.085" (2.16mm); Material Flammability Rating: UL94 V-0; Voltage Rating: 675VAC, 954VDC; Supplier 1: Digi-Key; Supplier Part Number 1: SAM10566-ND; Manufacturer Part Number 1: IPL1-102-01-L-S-RA-K; RoHS 1: RoHS Compliant; Description 1: CONN SHROUDED PWR HEADER 2POS; Stock 1: 0; Pricing 1: 1=2.44, 10=2.217, 25=2.0816, 50=1.991, 100=1.9005, 250=1.71952, 500=1.58376, 1000=1.3575, 2500=1.267 (USD); Packaging: Tube; Part Status: Active; Connector Type: Header; Contact Type: Male Pin; Number of Rows: 1; Row Spacing - Mating: -; Mounting Type: Through Hole, Right Angle; Termination: Solder; Fastening Type: Locking Ramp; Overall Contact Length: -; Insulation Height: 0.240" (6.10mm); Contact Shape: Square; Contact Finish - Mating: Gold; Contact Finish Thickness - Mating: 10µin (0.25µm); Contact Finish - Post: Tin; Contact Material: Phosphor Bronze; Insulation Material: Liquid Crystal Polymer (LCP); Features: -; Operating Temperature: -55°C ~ 125°C; Ingress Protection: -; Insulation Color: Natural; Current Rating: -; Mated Stacking Heights: -; Contact Finish Thickness - Post: -; Applications: -; ComponentLink1URL: http://suddendocs.samtec.com/prints/ipl1-1xx-xx-xxx-s-xx-x-xx-mkt.pdf; ComponentLink1Description: http://suddendocs.samtec.com/prints/ipl1-1xx-xx-xxx-s-xx-x-xx-mkt.pdf
P8 = Header 3X2: Header, 3-Pin, Dual row; Manufacturer 1: Amphenol FCI; Manufacturer Part Number 1: 861400062YO2LF; Description 1: HEADER BERGSTIK; Category 1: Connectors, Interconnects; Pitch - Mating: 0.100" (2.54mm); Style: Board to Board or Cable; Shrouding: Unshrouded; Number of Positions: 6; Number of Positions Loaded: All; Contact Length - Mating: 0.276" (7.00mm); Contact Length - Post: 0.118" (3.00mm); Overall Contact Length: 0.496" (12.60mm); Material Flammability Rating: UL94 V-0; Current Rating: 3A; Voltage Rating: 1000V; Supplier 1: Digi-Key; Supplier Part Number 1: 861400062YO2LF-ND; RoHS 1: RoHS Compliant; Stock 1: 0; Pricing 1: 6000=0.09952 (USD); Packaging: Bulk; Part Status: Active; Connector Type: Header; Contact Type: Male Pin; Number of Rows: 2; Row Spacing - Mating: 0.100" (2.54mm); Mounting Type: Through Hole; Termination: Solder; Fastening Type: -; Insulation Height: 0.102" (2.60mm); Contact Shape: Square; Contact Finish - Mating: Gold or Gold, GXT™; Contact Finish Thickness - Mating: 8µin (0.20µm); Contact Finish - Post: -; Contact Material: Copper Alloy; Insulation Material: Thermoplastic; Features: -; Operating Temperature: -55°C ~ 125°C; Ingress Protection: -; Insulation Color: -; Mated Stacking Heights: -; Contact Finish Thickness - Post: -; Applications: -; ComponentLink1URL: http://portal.fciconnect.com/Comergent//fci/drawing/c-8614-0086.pdf; ComponentLink1Description: http://portal.fciconnect.com/Comergent//fci/drawing/c-8614-0086.pdf
P11 = Header 5H: Header, 5-Pin, Right Angle; Manufacturer 1: Samtec Inc.; Description 1: .100 TERMINAL ASSEMBLY; Category 1: Connectors, Interconnects; Pitch - Mating: 0.100" (2.54mm); Style: Board to Cable/Wire; Shrouding: Shrouded - 4 Wall; Number of Positions: 5; Number of Positions Loaded: All; Contact Length - Mating: 0.215" (5.46mm); Contact Length - Post: 0.085" (2.16mm); Material Flammability Rating: UL94 V-0; Voltage Rating: 675VAC, 954VDC; Supplier 1: Digi-Key; Supplier Part Number 1: IPL1-105-01-F-S-RA-K-ND; Manufacturer Part Number 1: IPL1-105-01-F-S-RA-K; RoHS 1: RoHS Compliant; Stock 1: 0; Pricing 1: 1=2.46 (USD); Packaging: Tube; Part Status: Active; Connector Type: Header; Contact Type: Male Pin; Number of Rows: 1; Row Spacing - Mating: -; Mounting Type: Through Hole, Right Angle; Termination: Solder; Fastening Type: Locking Ramp; Overall Contact Length: -; Insulation Height: 0.240" (6.10mm); Contact Shape: Square; Contact Finish - Mating: Gold; Contact Finish Thickness - Mating: 3µin (0.08µm); Contact Finish - Post: Tin; Contact Material: Phosphor Bronze; Insulation Material: Liquid Crystal Polymer (LCP); Features: -; Operating Temperature: -55°C ~ 125°C; Ingress Protection: -; Insulation Color: Natural; Current Rating: -; Mated Stacking Heights: -; Contact Finish Thickness - Post: -; Applications: -; ComponentLink1URL: http://suddendocs.samtec.com/prints/ipl1-1xx-xx-xxx-s-xx-x-xx-mkt.pdf; ComponentLink1Description: http://suddendocs.samtec.com/prints/ipl1-1xx-xx-xxx-s-xx-x-xx-mkt.pdf
P14 = Header 20X2: 1MM SINGLE ELEMENT INTERFACE; Manufacturer 1: Samtec Inc.; Manufacturer Part Number 1: FSI-120-03-G-D-M-AB; Category 1: Connectors, Interconnects; Connector Type: Stacking Compression; Number of Positions: 40; Pitch: 0.039" (1.00mm); Supplier 1: Digi-Key; Supplier Part Number 1: SAM9413-ND; RoHS 1: RoHS Compliant; Description 1: 1MM SINGLE ELEMENT INTERFACE; Stock 1: 144; Pricing 1: 1=8.38, 10=7.752, 25=7.3324, 50=6.9554, 100=6.4945, 250=5.65652, 500=5.447, 1000=5.2375, 2500=5.028 (USD); Packaging: Tube; Part Status: Active; Number of Rows: 2; Mounting Type: Surface Mount; Features: Board Guide, Mounting Flange; Contact Finish: Gold; Contact Finish Thickness: 10µin (0.25µm); Mated Stacking Heights: -; Height Above Board: 0.118" (3.00mm); ComponentLink1URL: http://suddendocs.samtec.com/prints/fsi-1xx-03-x-d-x-xx-xx-mkt.pdf; ComponentLink1Description: http://suddendocs.samtec.com/prints/fsi-1xx-03-x-d-x-xx-xx-mkt.pdf
P15 = Header 6H: CABLE USB SERIAL 3.3V 2MM HEADER; Manufacturer 1: FTDI, Future Technology Devices International Ltd; Manufacturer Part Number 1: TTL-232R-3V3-2MM; Category 1: Cable Assemblies; Usage: USB to TTL Serial 3.3V; Convert From (Adapter End): USB - A, Plug; Convert To (Adapter End): Rectangular Connector, Female Sockets, 8 pos (7 open), 2mm; Shielding: Unshielded; Supplier 1: Digi-Key; Supplier Part Number 1: 768-1095-ND; RoHS 1: RoHS Compliant; Description 1: CABLE USB SERIAL 3.3V 2MM HEADER; Stock 1: 274; Pricing 1: 1=20, 10=18, 50=16.875 (USD); Part Status: Active; Length: 5.90' (1.80m); ComponentLink1URL: http://www.ftdichip.com/Support/Documents/DataSheets/Cables/DS_TTL-232R_CABLES.pdf; ComponentLink1Description: http://www.ftdichip.com/Support/Documents/DataSheets/Cables/DS_TTL-232R_CABLES.pdf
P16-P19 = Header 2X2H: CONN WIRE TO BOARD HDR 4 POS; Manufacturer 1: Samtec Inc.; Category 1: Connectors, Interconnects; Connector Type: Header; Pitch - Mating: 0.100" (2.54mm); Style: Board to Cable/Wire; Shrouding: Shrouded - 4 Wall; Number of Positions: 4; Number of Positions Loaded: All; Contact Length - Mating: 0.215" (5.46mm); Material Flammability Rating: UL94 V-0; Voltage Rating: 675VAC, 954VDC; Supplier 1: Digi-Key; Supplier Part Number 1: SAM10572-ND; Manufacturer Part Number 1: IPL1-102-02-S-D-K; RoHS 1: RoHS Compliant; Description 1: CONN WIRE TO BOARD HDR 4 POS; Stock 1: 0; Pricing 1: 1=4.68, 10=4.488, 25=4.114, 50=3.927, 100=3.74, 250=3.27252, 500=3.179, 1000=2.7115, 2500=2.5245 (USD); Packaging: Tube; Part Status: Active; Contact Type: Male Pin; Number of Rows: 2; Row Spacing - Mating: 0.100" (2.54mm); Mounting Type: Surface Mount; Termination: Solder; Fastening Type: Locking Ramp; Contact Length - Post: -; Overall Contact Length: -; Insulation Height: 0.320" (8.13mm); Contact Shape: Square; Contact Finish - Mating: Gold; Contact Finish Thickness - Mating: 30µin (0.76µm); Contact Finish - Post: Tin; Contact Material: Phosphor Bronze; Insulation Material: Liquid Crystal Polymer (LCP); Features: -; Operating Temperature: -55°C ~ 125°C; Ingress Protection: -; Insulation Color: Natural; Current Rating: -; Mated Stacking Heights: -; Contact Finish Thickness - Post: -; Applications: -; ComponentLink1URL: http://suddendocs.samtec.com/prints/ipl1-1xx-xx-xxx-d-xx-x-xx-mkt.pdf; ComponentLink1Description: http://suddendocs.samtec.com/prints/ipl1-1xx-xx-xxx-d-xx-x-xx-mkt.pdf
P20 = Header 3X2H: CONN SHROUDED PWR HEADER 3POS; Manufacturer 1: Samtec Inc.; Category 1: Connectors, Interconnects; Pitch - Mating: 0.100" (2.54mm); Style: Board to Cable/Wire; Shrouding: Shrouded - 4 Wall; Number of Positions: 6; Number of Positions Loaded: All; Contact Length - Mating: 0.215" (5.46mm); Material Flammability Rating: UL94 V-0; Voltage Rating: 675VAC, 954VDC; Supplier 1: Digi-Key; Supplier Part Number 1: SAM10574-ND; Manufacturer Part Number 1: IPL1-103-02-L-D-K; RoHS 1: RoHS Compliant; Description 1: CONN SHROUDED PWR HEADER 3POS; Stock 1: 180; Pricing 1: 1=3.13, 10=3, 25=2.75, 50=2.625, 100=2.5, 250=2.18752, 500=2.125, 1000=1.8125, 2500=1.6875 (USD); Packaging: Tube; Part Status: Active; Connector Type: Header; Contact Type: Male Pin; Number of Rows: 2; Row Spacing - Mating: 0.100" (2.54mm); Mounting Type: Surface Mount; Termination: Solder; Fastening Type: Locking Ramp; Contact Length - Post: -; Overall Contact Length: -; Insulation Height: 0.320" (8.13mm); Contact Shape: Square; Contact Finish - Mating: Gold; Contact Finish Thickness - Mating: 10µin (0.25µm); Contact Finish - Post: Tin; Contact Material: Phosphor Bronze; Insulation Material: Liquid Crystal Polymer (LCP); Features: -; Operating Temperature: -55°C ~ 125°C; Ingress Protection: -; Insulation Color: Natural; Current Rating: -; Mated Stacking Heights: -; Contact Finish Thickness - Post: -; Applications: -; ComponentLink1URL: http://suddendocs.samtec.com/prints/ipl1-1xx-xx-xxx-d-xx-x-xx-mkt.pdf; ComponentLink1Description: http://suddendocs.samtec.com/prints/ipl1-1xx-xx-xxx-d-xx-x-xx-mkt.pdf
Q1-Q5 = MOSFET-N4: N-Channel MOSFET, Externally Terminated Substrate; Manufacturer 1: Infineon Technologies; Description 1: MOSFET N-CH 30V 160A DPAK; Category 1: Discrete Semiconductor Products; Drain to Source Voltage (Vdss): 30V; Current - Continuous Drain (Id) @ 25°C: 160A (Tc); Drive Voltage (Max Rds On,  Min Rds On): 4.5V, 10V; Vgs(th) (Max) @ Id: 2.35V @ 100µA; Gate Charge (Qg) (Max) @ Vgs: 59nC @ 4.5V; Input Capacitance (Ciss) (Max) @ Vds: 4880pF @ 15V; Vgs (Max): ±20V; Power Dissipation (Max): 135W (Tc); Rds On (Max) @ Id, Vgs: 3.1 mOhm @ 25A, 10V; Supplier 1: Digi-Key; Supplier Part Number 1: IRLR8743PBF-ND; Manufacturer Part Number 1: IRLR8743PBF; RoHS 1: RoHS Compliant; Stock 1: 557; Pricing 1: 1=1.29, 10=1.152, 100=0.8984, 500=0.74214, 1000=0.5859 (USD); Packaging: Tube; Part Status: Not For New Designs; FET Type: N-Channel; Technology: MOSFET (Metal Oxide); FET Feature: -; Operating Temperature: -55°C ~ 175°C (TJ); Mounting Type: Surface Mount; Supplier Device Package: D-Pak; Package / Case: TO-252-3, DPak (2 Leads + Tab), SC-63; ComponentLink1URL: http://www.irf.com/product-info/datasheets/data/irlr8743pbf.pdf; ComponentLink1Description: http://www.irf.com/product-info/datasheets/data/irlr8743pbf.pdf
R1 R4 R15-R18 R20 R26 R34 = CMP-1013-00017-1: Manufacturer: Vishay Dale; Manufacturer Part Number: CRCW08050000Z0EA; Power (Watts): 0.125W, 1/8W; Supplier 1: Digi-Key; Supplier Part Number 1: 541-0.0ADKR-ND; RoHS: RoHS Compliant; Category: Resistors; Pricing 1: 1=0.1, 10=0.026, 25=0.0184, 50=0.014, 100=0.0104, 250=0.00792, 500=0.00634, 1000=0.00466 (USD); Packaging: Digi-Reel®; Part Status: Active; Tolerance: Jumper; Composition: Thick Film; Features: Automotive AEC-Q200; Temperature Coefficient: -; Operating Temperature: -55°C ~ 155°C; Package / Case: 0805 (2012 Metric); Supplier Device Package: 0805; Size / Dimension: 0.079" L x 0.049" W (2.00mm x 1.25mm); Height - Seated (Max): 0.020" (0.50mm); Failure Rate: -; ComponentLink1URL: http://www.vishay.com/docs/20035/dcrcwe3.pdf; ComponentLink1Description: http://www.vishay.com/docs/20035/dcrcwe3.pdf
  R1: Stock 1: 869775